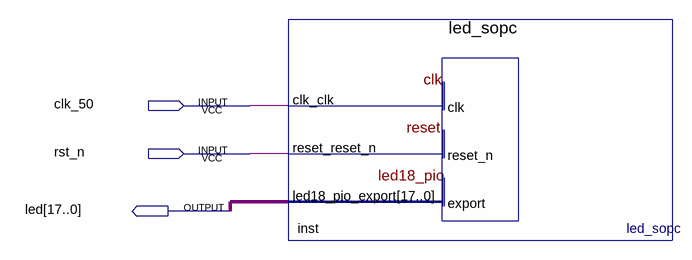
[diagram p0: schematic sheet]
// Quartus schematic led.bdf as structural Verilog: 1 symbols, 3 pins
module led (
  input  clk_50,
  input  rst_n,
  output [17:0] led
);

  led_sopc inst (.clk_clk(clk_50), .reset_reset_n(rst_n), .led18_pio_export(led));
endmodule
